# Altium schematic sheet Linear regulators.SchDoc (part 3 of 3)
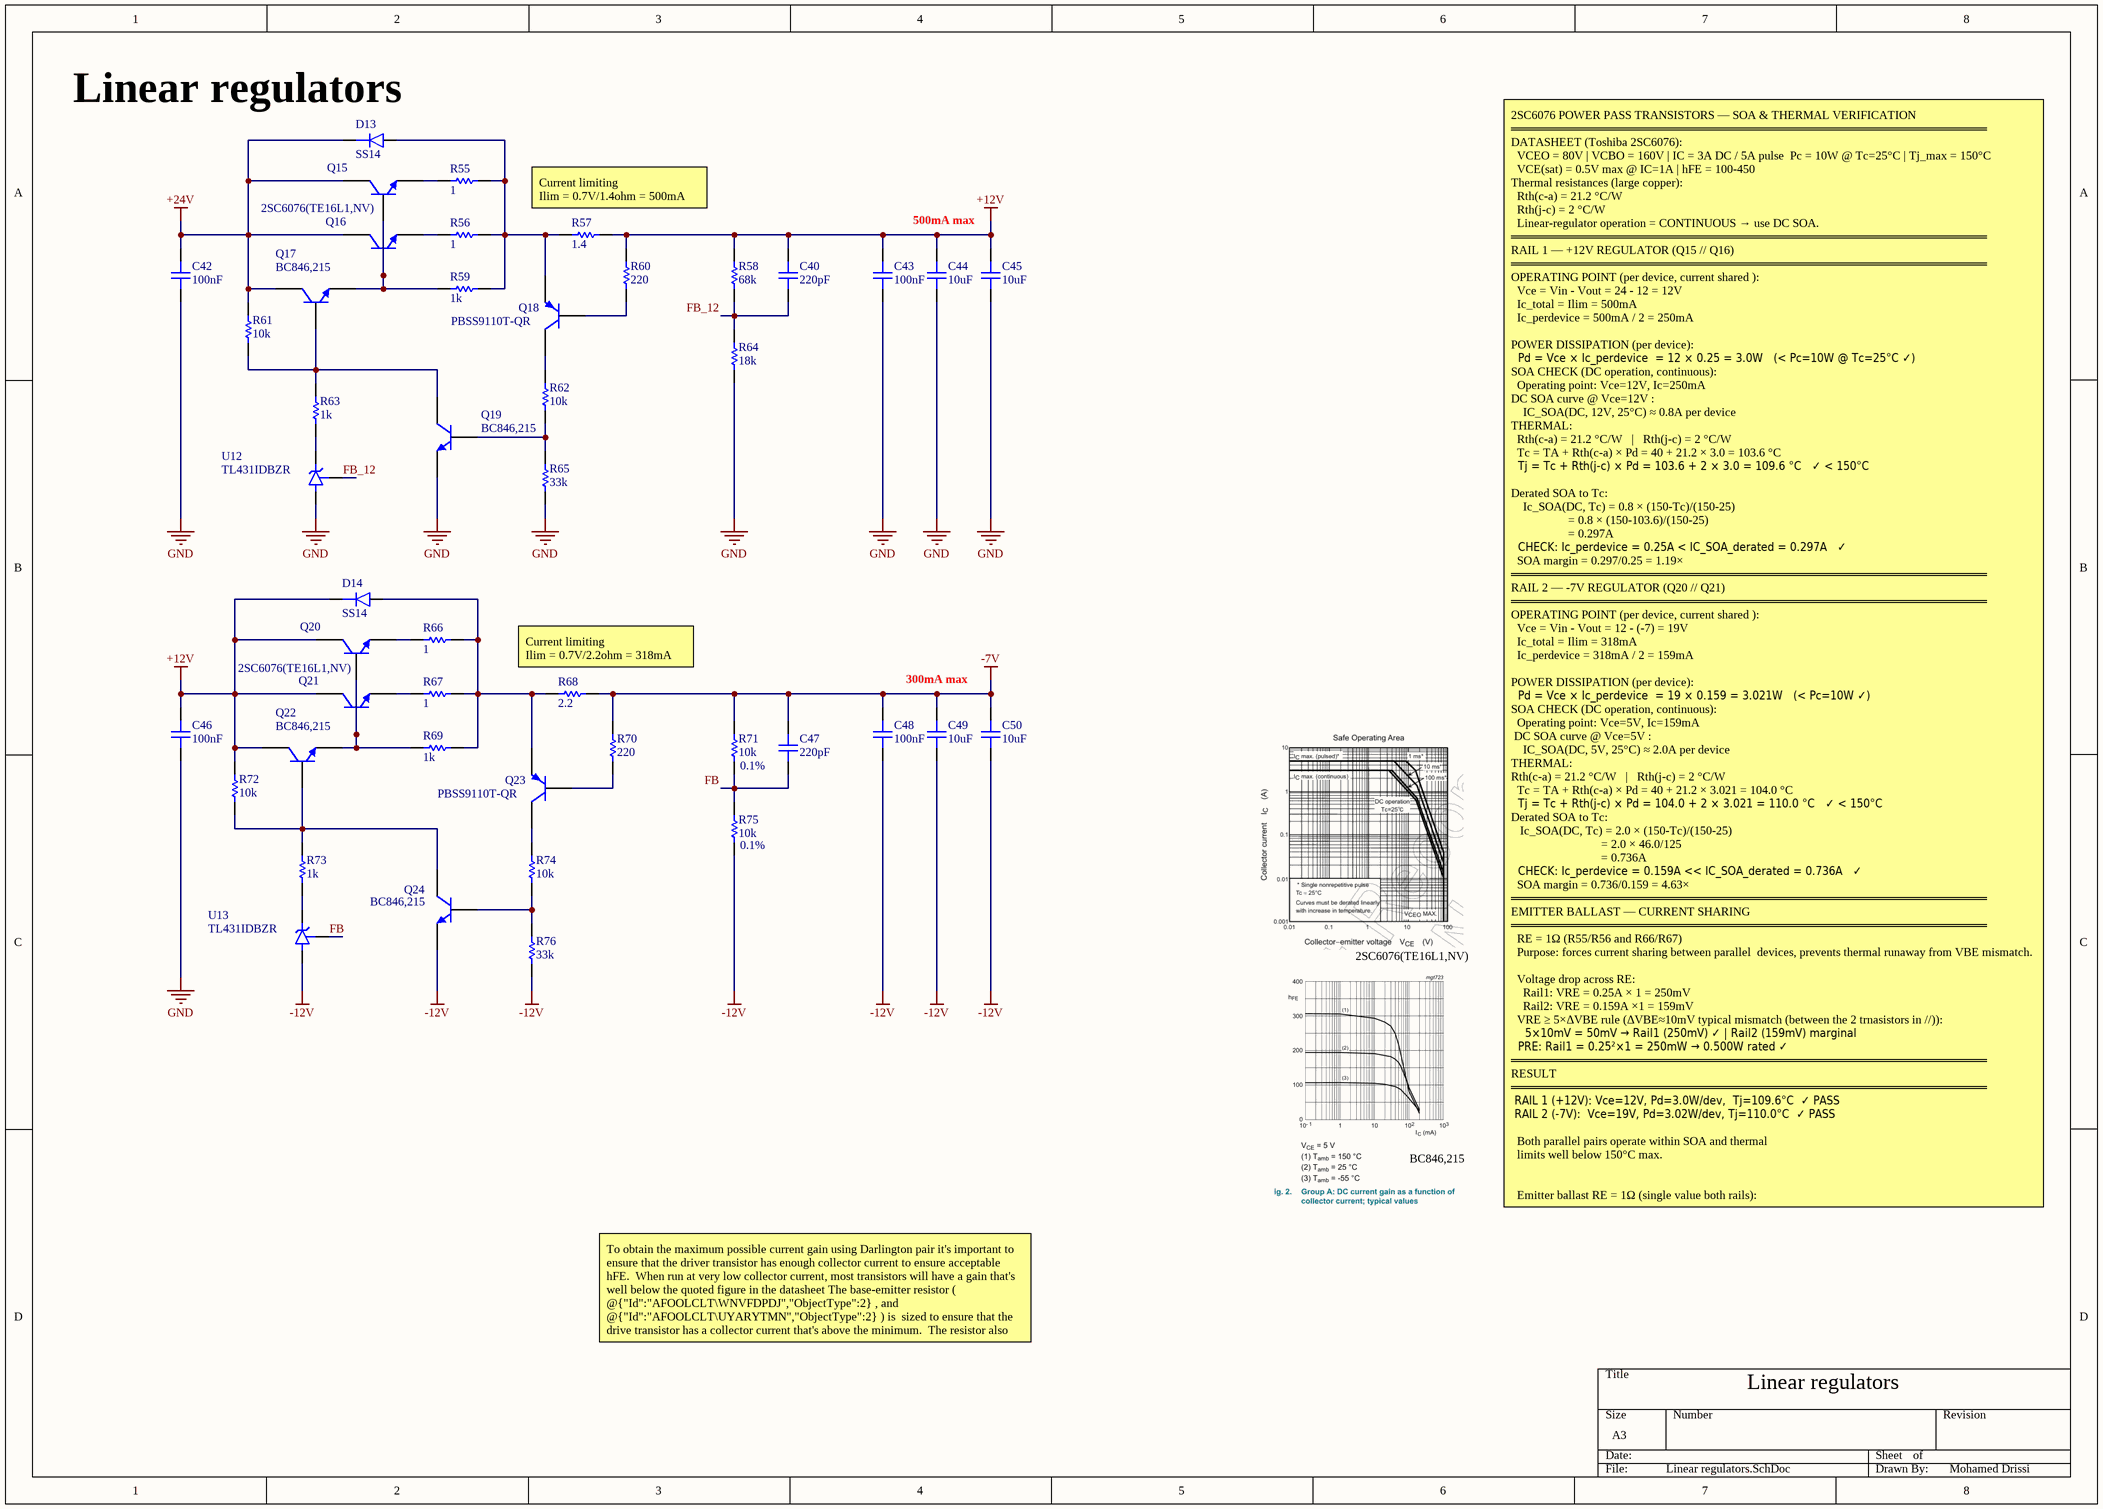
[diagram p2: Linear regulators.SchDoc]

## Library data of the parts (continued)
R65 R76 = Yageo RC0603JR-0733KL: 100mW Thick Film Resistors 75V ±100ppm/℃ ±5% 33kΩ 0603 Chip Resistor - Surface Mount ROHS; Manufacturer: Yageo Group; Temperature Coefficient: 100ppm/°C; Voltage Rating (AC): 50V; Supplier: RS; Supplier Part Number: 2426788; Manufacturer Part Number: RC0603JR-0733KL; RoHS: Compliant; Category: Chip SMD Resistors; Stock: 3000; Pricing: 100=0,006, 1000=0,005, 2000=0,004 (EUR); Case/Package: 0603; Case Code (Imperial): 0603; China RoHS: Non-Compliant; Composition: Thick Film; Depth: 800µm; Features: Moisture Resistant; Height: 450µm; Lead Free: Lead Free; Length: 1.6mm; Lifecycle Status: Production; Max Operating Temperature: 155°C; Max Power Dissipation: 100mW; Military Standard: Not; Min Operating Temperature: -55°C; Mounting Technology: Surface Mount; Pins: 2; Number of Terminals: 2; Number of Terminations: 2; Packaging: Tape & Reel; Power Rating: 100mW; REACH SVHC: Yes; Schedule B: 8533210045, 8533210045|8533210045|8533210045|8533210045|8533210045|8533210045|8533210045|8533210045|8533210045|8533210045|8533210045|8533210045|8533210045, 8533210045|8533210045|8533210045|8533210045|8533210045|8533210045|8533210045|8533210045|8533210045|8533210045|8533210045|8533210045|8533210045|8533210045, 8533210045|8533210045|8533210045|8533210045|8533210045|8533210045|8533210045|8533210045|8533210045|8533210045|8533210045|8533210045|8533210045|8533210045|8533210045; Termination: SMD/SMT; Tolerance: 5%; Voltage Rating: 75V; Voltage Rating (DC): 50V; Weight: 2.012816mg; Width: 800µm; Working Voltage: 75V; ComponentLink1URL: https://datasheet.octopart.com:443/RC0603JR-0733KL-Yageo-datasheet-175887523.pdf?src-supplier=Newark; ComponentLink1Description: https://datasheet.octopart.com:443/RC0603JR-0733KL-Yageo-datasheet-175887523.pdf?src-supplier=Newark; ComponentLink2URL: https://datasheet.octopart.com:443/RC0603JR-0733KL-Yageo-datasheet-8328172.pdf?src-supplier=Newark; ComponentLink2Description: https://datasheet.octopart.com:443/RC0603JR-0733KL-Yageo-datasheet-8328172.pdf?src-supplier=Newark; ComponentLink3URL: https://datasheet.octopart.com:443/RC0603JR-0733KL-Yageo-Group-datasheet-190305687.pdf?src-supplier=Future+Electronics; ComponentLink3Description: https://datasheet.octopart.com:443/RC0603JR-0733KL-Yageo-Group-datasheet-190305687.pdf?src-supplier=Future+Electronics; ComponentLink4URL: https://datasheet.octopart.com:443/RC0603JR-0733KL-Yageo-datasheet-164759695.pdf?src-supplier=Future+Electronics; ComponentLink4Description: https://datasheet.octopart.com:443/RC0603JR-0733KL-Yageo-datasheet-164759695.pdf?src-supplier=Future+Electronics; ComponentLink5URL: https://datasheet.octopart.com:443/RC0603JR-0733KL-Yageo-datasheet-137700087.pdf?src-supplier=Future+Electronics; ComponentLink5Description: https://datasheet.octopart.com:443/RC0603JR-0733KL-Yageo-datasheet-137700087.pdf?src-supplier=Future+Electronics; ComponentLink6URL: https://datasheet.octopart.com:443/RC0603JR-0733KL-Yageo-datasheet-27584510.pdf?src-supplier=Future+Electronics; ComponentLink6Description: https://datasheet.octopart.com:443/RC0603JR-0733KL-Yageo-datasheet-27584510.pdf?src-supplier=Future+Electronics; ComponentLink7URL: https://datasheet.octopart.com:443/RC0603JR-0733KL-Yageo-datasheet-15599030.pdf?src-supplier=Future+Electronics; ComponentLink7Description: https://datasheet.octopart.com:443/RC0603JR-0733KL-Yageo-datasheet-15599030.pdf?src-supplier=Future+Electronics; ComponentLink8URL: https://datasheet.octopart.com:443/RC0603JR-0733KL-Yageo-datasheet-12596169.pdf?src-supplier=Future+Electronics; ComponentLink8Description: https://datasheet.octopart.com:443/RC0603JR-0733KL-Yageo-datasheet-12596169.pdf?src-supplier=Future+Electronics; ComponentLink9URL: https://datasheet.octopart.com:443/RC0603JR-0733KL-Yageo-datasheet-8324193.pdf?src-supplier=Future+Electronics; ComponentLink9Description: https://datasheet.octopart.com:443/RC0603JR-0733KL-Yageo-datasheet-8324193.pdf?src-supplier=Future+Electronics; ComponentLink10URL: https://datasheet.octopart.com:443/RC0603JR-0733KL-Yageo-datasheet-62067350.pdf?src-supplier=element14+APAC; ComponentLink10Description: https://datasheet.octopart.com:443/RC0603JR-0733KL-Yageo-datasheet-62067350.pdf?src-supplier=element14+APAC; ComponentLink11URL: https://datasheet.octopart.com:443/RC0603JR-0733KL-Yageo-datasheet-34211833.pdf?src-supplier=element14+APAC; ComponentLink11Description: https://datasheet.octopart.com:443/RC0603JR-0733KL-Yageo-datasheet-34211833.pdf?src-supplier=element14+APAC; ComponentLink12URL: https://datasheet.octopart.com/RC0603JR-0733KL-Yageo-datasheet-73766026.pdf; ComponentLink12Description: https://datasheet.octopart.com/RC0603JR-0733KL-Yageo-datasheet-73766026.pdf; ComponentLink13URL: https://datasheet.octopart.com:443/RC0603JR-0733KL-Yageo-datasheet-118562.pdf?src-supplier=DigiKey; ComponentLink13Description: https://datasheet.octopart.com:443/RC0603JR-0733KL-Yageo-datasheet-118562.pdf?src-supplier=DigiKey; ComponentLink14URL: http://sigma.octopart.com:80/conflict_mineral_statement/Yageo-company-3.pdf?src-supplier=Compliance+Statements; ComponentLink14Description: http://sigma.octopart.com:80/conflict_mineral_statement/Yageo-company-3.pdf?src-supplier=Compliance+Statements; ComponentLink15URL: http://sigma.octopart.com:80/rohs_statement/Yageo-company-2.pdf?src-supplier=Compliance+Statements; ComponentLink15Description: http://sigma.octopart.com:80/rohs_statement/Yageo-company-2.pdf?src-supplier=Compliance+Statements
R68 = Bourns CRM1206-JW-2R2ELF: Res Thick Film 1206 2.2 Ohm 5% 0.5W(1/2W) ±200ppm/C Pad SMD T/R; Manufacturer: Bourns; Max Power Dissipation: 500mW; Temperature Coefficient: 200ppm/°C; Voltage Rating: 200V; Supplier: RS; Supplier Part Number: 630160; Manufacturer Part Number: CRM1206-JW-2R2ELF; RoHS: Compliant; Category: Chip SMD Resistors; Stock: 9920; Pricing: 20=0,049, 500=0,042, 2000=0,032, 10000=0,028, 20000=0,021 (EUR); Case/Package: 1206; Case Code (Imperial): 1206; Case Code (Metric): 3216; China RoHS: Non-Compliant; Composition: Thick Film; Country of Origin: Taiwan; Depth: 1.6mm; Export Control Classification Number (ECCN) Code: EAR99; Height: 550µm; Harmonized Tariff Schedule (HTS) Code: 8533.21.00.30; Introduction Date: 2011-02-17; Length: 3.1mm; Lifecycle Status: Production; Max Operating Temperature: 155°C; Military Standard: Not; Min Operating Temperature: -55°C; Mounting Technology: Surface Mount; Pins: 2; Number of Terminals: 2; Number of Terminations: 2; Packaging: Cut Tape; Power Rating: 500mW; REACH SVHC: Yes; Schedule B: 8533210045, 8533210045|8533210045, 8533210045|8533210045|8533210045, 8533210045|8533210045|8533210045|8533210045; Tolerance: 5%; Voltage Rating (DC): 200V; Width: 1.6mm; Working Voltage: 200V; ComponentLink1URL: https://datasheet.octopart.com:443/CRM1206-JW-2R2ELF-Bourns-datasheet-182141858.pdf?src-supplier=Master+Electronics; ComponentLink1Description: https://datasheet.octopart.com:443/CRM1206-JW-2R2ELF-Bourns-datasheet-182141858.pdf?src-supplier=Master+Electronics; ComponentLink2URL: https://datasheet.octopart.com:443/CRM1206-JW-2R2ELF-Bourns-datasheet-164353756.pdf?src-supplier=JRH+Electronics; ComponentLink2Description: https://datasheet.octopart.com:443/CRM1206-JW-2R2ELF-Bourns-datasheet-164353756.pdf?src-supplier=JRH+Electronics; ComponentLink3URL: https://datasheet.octopart.com:443/CRM1206-JW-2R2ELF-Bourns-datasheet-97424573.pdf?src-supplier=Burklin+Elektronik; ComponentLink3Description: https://datasheet.octopart.com:443/CRM1206-JW-2R2ELF-Bourns-datasheet-97424573.pdf?src-supplier=Burklin+Elektronik; ComponentLink4URL: https://datasheet.octopart.com:443/CRM1206-JW-2R2ELF-Bourns-datasheet-154729671.pdf?src-supplier=Electro+Sonic; ComponentLink4Description: https://datasheet.octopart.com:443/CRM1206-JW-2R2ELF-Bourns-datasheet-154729671.pdf?src-supplier=Electro+Sonic; ComponentLink5URL: https://datasheet.octopart.com:443/CRM1206-JW-2R2ELF-Bourns-datasheet-10026694.pdf?src-supplier=element14; ComponentLink5Description: https://datasheet.octopart.com:443/CRM1206-JW-2R2ELF-Bourns-datasheet-10026694.pdf?src-supplier=element14; ComponentLink6URL: https://datasheet.octopart.com:443/CRM1206-JW-2R2ELF-Bourns-datasheet-33021211.pdf?src-supplier=Newark; ComponentLink6Description: https://datasheet.octopart.com:443/CRM1206-JW-2R2ELF-Bourns-datasheet-33021211.pdf?src-supplier=Newark; ComponentLink7URL: https://datasheet.octopart.com:443/CRM1206-JW-2R2ELF-Bourns-datasheet-27379021.pdf?src-supplier=Newark; ComponentLink7Description: https://datasheet.octopart.com:443/CRM1206-JW-2R2ELF-Bourns-datasheet-27379021.pdf?src-supplier=Newark; ComponentLink8URL: https://datasheet.octopart.com:443/CRM1206-JW-2R2ELF-Bourns-datasheet-21196278.pdf?src-supplier=Newark; ComponentLink8Description: https://datasheet.octopart.com:443/CRM1206-JW-2R2ELF-Bourns-datasheet-21196278.pdf?src-supplier=Newark; ComponentLink9URL: http://sigma.octopart.com:80/conflict_mineral_statement/Bourns-company-36.pdf?src-supplier=Compliance+Statements; ComponentLink9Description: http://sigma.octopart.com:80/conflict_mineral_statement/Bourns-company-36.pdf?src-supplier=Compliance+Statements
U12 U13 = TI TL431IDBZR: V-Ref Adjustable 2.495V to 36V 100mA Automotive 3-Pin SOT-23 T/R; Manufacturer: Texas Instruments; Manufacturer Lifecycle Status: ACTIVE; Cathode Current: 1mA; Max Supply Voltage: 37V; Number of Channels: 1; Reference Type: Adjustable, Shunt; Temperature Coefficient: 34ppm/°C; Tolerance: 2%; Supplier: Arrow Electronics; Supplier Part Number: TL431IDBZR; Manufacturer Part Number: TL431IDBZR; RoHS: Compliant; Category: Voltage References; Stock: 51000; Pricing: 3000=0,0918, 6000=0,0907, 9000=0,0882, 15000=0,0874, 21000=0,0865, 30000=0,0823 (USD); Case/Package: SOT-23; Height: 1.22mm; Lead Free: Lead Free; Length: 2.92mm; Lifecycle Status: Production; Max Operating Temperature: 85°C; Max Output current: 100mA; Max Output Voltage: 36V; Min Input Voltage: 2.495V; Min Operating Temperature: -40°C; Pins: 3; Output Current: 100mA; Output Voltage: 36V; Packaging: Cut Tape; Radiation Hardening: No; REACH SVHC: No; Reference Voltage: 36V; Schedule B: 8542390000, 8542390000|8542390000|8542390000|8542390000|8542390000; Thickness: 1mm; Weight: 1.437803g; Width: 1.3mm; ComponentLink1URL: https://sigma.octopart.com:443/179129137/technical_drawing/Texas-Instruments-TL431IDBZR.pdf?src-supplier=Texas+Instruments; ComponentLink1Description: https://sigma.octopart.com:443/179129137/technical_drawing/Texas-Instruments-TL431IDBZR.pdf?src-supplier=Texas+Instruments; ComponentLink2URL: https://octopart.com:443/opatz8j6/c1?t=rW6bIrba_jbvmB_uabgQ4DHQ_8bXebmw5n36TFgajg_cM10sTUMOa3c0_aROWTzNuODAPxgdzkUCyLMyjqW5ECfNLnsPaaELSSqte_UXEwTAXn63sCq0zOIbeu3rbiILGc0xAKExe2TPYtg5Ms4ml5aZB-hP2d9WeynMm8uqMp-0nIZVL-dEP5eqV8i1QpquQEXyisrE4V8pFSHbvg01nxHcb9gAO0LAPA1OgW6fj5N8dHmskhhoOlj6gaEdyF9jXEJmJUbnrXDzuao32M8w1z1jkibRnCgcbwk3b-Z8PYiflKC4Jzxffmw6AAaWjNeE2_Iqkn9MenYhHERA89N4870fEFKw1TPybVjTNvPhj-8IMEBDTyhXkE4nZuLn3P6NpQ&src-supplier=Texas+Instruments; ComponentLink2Description: https://octopart.com:443/opatz8j6/c1?t=rW6bIrba_jbvmB_uabgQ4DHQ_8bXebmw5n36TFgajg_cM10sTUMOa3c0_aROWTzNuODAPxgdzkUCyLMyjqW5ECfNLnsPaaELSSqte_UXEwTAXn63sCq0zOIbeu3rbiILGc0xAKExe2TPYtg5Ms4ml5aZB-hP2d9WeynMm8uqMp-0nIZVL-dEP5eqV8i1QpquQEXyisrE4V8pFSHbvg01nxHcb9gAO0LAPA1OgW6fj5N8dHmskhhoOlj6gaEdyF9jXEJmJUbnrXDzuao32M8w1z1jkibRnCgcbwk3b-Z8PYiflKC4Jzxffmw6AAaWjNeE2_Iqkn9MenYhHERA89N4870fEFKw1TPybVjTNvPhj-8IMEBDTyhXkE4nZuLn3P6NpQ&src-supplier=Texas+Instruments; ComponentLink3URL: https://sigma.octopart.com:443/169406038/technical_drawing/Texas-Instruments-TL431IDBZR.pdf?src-supplier=Texas+Instruments; ComponentLink3Description: https://sigma.octopart.com:443/169406038/technical_drawing/Texas-Instruments-TL431IDBZR.pdf?src-supplier=Texas+Instruments; ComponentLink4URL: https://sigma.octopart.com:443/80351974/technical_drawing/Texas-Instruments-TL431IDBZR.pdf?src-supplier=Texas+Instruments; ComponentLink4Description: https://sigma.octopart.com:443/80351974/technical_drawing/Texas-Instruments-TL431IDBZR.pdf?src-supplier=Texas+Instruments; ComponentLink5URL: https://sigma.octopart.com:443/78374974/technical_drawing/Texas-Instruments-TL431IDBZR.pdf?src-supplier=Texas+Instruments; ComponentLink5Description: https://sigma.octopart.com:443/78374974/technical_drawing/Texas-Instruments-TL431IDBZR.pdf?src-supplier=Texas+Instruments; ComponentLink6URL: https://datasheet.octopart.com:443/TL431IDBZR-Texas-Instruments-datasheet-41217836.pdf?src-supplier=Texas+Instruments; ComponentLink6Description: https://datasheet.octopart.com:443/TL431IDBZR-Texas-Instruments-datasheet-41217836.pdf?src-supplier=Texas+Instruments; ComponentLink7URL: https://datasheet.octopart.com:443/TL431IDBZR-Texas-Instruments-datasheet-37140784.pdf?src-supplier=Texas+Instruments; ComponentLink7Description: https://datasheet.octopart.com:443/TL431IDBZR-Texas-Instruments-datasheet-37140784.pdf?src-supplier=Texas+Instruments; ComponentLink8URL: https://datasheet.octopart.com:443/TL431IDBZR-Texas-Instruments-datasheet-22066926.pdf?src-supplier=Texas+Instruments; ComponentLink8Description: https://datasheet.octopart.com:443/TL431IDBZR-Texas-Instruments-datasheet-22066926.pdf?src-supplier=Texas+Instruments; ComponentLink9URL: https://datasheet.octopart.com:443/TL431IDBZR-Texas-Instruments-datasheet-11514612.pdf?src-supplier=Texas+Instruments; ComponentLink9Description: https://datasheet.octopart.com:443/TL431IDBZR-Texas-Instruments-datasheet-11514612.pdf?src-supplier=Texas+Instruments; ComponentLink10URL: https://datasheet.octopart.com:443/TL431IDBZR-Texas-Instruments-datasheet-149617.pdf?src-supplier=Texas+Instruments; ComponentLink10Description: https://datasheet.octopart.com:443/TL431IDBZR-Texas-Instruments-datasheet-149617.pdf?src-supplier=Texas+Instruments; ComponentLink11URL: https://sigma.octopart.com:443/49250660/technical_drawing/Texas-Instruments-TL431IDBZR.pdf?src-supplier=Texas+Instruments; ComponentLink11Description: https://sigma.octopart.com:443/49250660/technical_drawing/Texas-Instruments-TL431IDBZR.pdf?src-supplier=Texas+Instruments; ComponentLink12URL: https://datasheet.octopart.com:443/TL431IDBZR-Texas-Instruments-datasheet-10255933.pdf?src-supplier=Texas+Instruments; ComponentLink12Description: https://datasheet.octopart.com:443/TL431IDBZR-Texas-Instruments-datasheet-10255933.pdf?src-supplier=Texas+Instruments; ComponentLink13URL: https://datasheet.octopart.com:443/TL431IDBZR-Texas-Instruments-datasheet-81843928.pdf?src-supplier=Upverter; ComponentLink13Description: https://datasheet.octopart.com:443/TL431IDBZR-Texas-Instruments-datasheet-81843928.pdf?src-supplier=Upverter; ComponentLink14URL: https://datasheet.octopart.com:443/TL431IDBZR-Texas-Instruments-datasheet-14437413.pdf?src-supplier=Upverter; ComponentLink14Description: https://datasheet.octopart.com:443/TL431IDBZR-Texas-Instruments-datasheet-14437413.pdf?src-supplier=Upverter; ComponentLink15URL: https://datasheet.octopart.com:443/TL431IDBZR-Texas-Instruments-datasheet-66581701.pdf?src-supplier=Farnell; ComponentLink15Description: https://datasheet.octopart.com:443/TL431IDBZR-Texas-Instruments-datasheet-66581701.pdf?src-supplier=Farnell; ComponentLink16URL: https://datasheet.octopart.com:443/TL431IDBZR-Texas-Instruments-datasheet-165804567.pdf?src-supplier=LCSC; ComponentLink16Description: https://datasheet.octopart.com:443/TL431IDBZR-Texas-Instruments-datasheet-165804567.pdf?src-supplier=LCSC; ComponentLink17URL: https://datasheet.octopart.com:443/TL431IDBZR-Texas-Instruments-datasheet-159117715.pdf?src-supplier=LCSC; ComponentLink17Description: https://datasheet.octopart.com:443/TL431IDBZR-Texas-Instruments-datasheet-159117715.pdf?src-supplier=LCSC; ComponentLink18URL: https://datasheet.octopart.com:443/TL431IDBZR-Texas-Instruments-datasheet-164418451.pdf?src-supplier=SHENGYU+ELECTRONICS; ComponentLink18Description: https://datasheet.octopart.com:443/TL431IDBZR-Texas-Instruments-datasheet-164418451.pdf?src-supplier=SHENGYU+ELECTRONICS; ComponentLink19URL: https://datasheet.octopart.com:443/TL431IDBZR-Texas-Instruments-datasheet-95954503.pdf?src-supplier=TME; ComponentLink19Description: https://datasheet.octopart.com:443/TL431IDBZR-Texas-Instruments-datasheet-95954503.pdf?src-supplier=TME; ComponentLink20URL: https://datasheet.octopart.com:443/TL431IDBZR-Texas-Instruments-datasheet-137316104.pdf?src-supplier=Future+Electronics; ComponentLink20Description: https://datasheet.octopart.com:443/TL431IDBZR-Texas-Instruments-datasheet-137316104.pdf?src-supplier=Future+Electronics; ComponentLink21URL: https://datasheet.octopart.com:443/TL431IDBZR-Texas-Instruments-datasheet-38226331.pdf?src-supplier=Newark; ComponentLink21Description: https://datasheet.octopart.com:443/TL431IDBZR-Texas-Instruments-datasheet-38226331.pdf?src-supplier=Newark; ComponentLink22URL: https://datasheet.octopart.com:443/TL431IDBZR-Texas-Instruments-datasheet-37140351.pdf?src-supplier=Newark; ComponentLink22Description: https://datasheet.octopart.com:443/TL431IDBZR-Texas-Instruments-datasheet-37140351.pdf?src-supplier=Newark; ComponentLink23URL: https://datasheet.octopart.com:443/TL431IDBZR-Texas-Instruments-datasheet-33011757.pdf?src-supplier=Newark; ComponentLink23Description: https://datasheet.octopart.com:443/TL431IDBZR-Texas-Instruments-datasheet-33011757.pdf?src-supplier=Newark; ComponentLink24URL: https://datasheet.octopart.com:443/TL431IDBZR-Texas-Instruments-datasheet-10882568.pdf?src-supplier=Arrow+Electronics; ComponentLink24Description: https://datasheet.octopart.com:443/TL431IDBZR-Texas-Instruments-datasheet-10882568.pdf?src-supplier=Arrow+Electronics; ComponentLink25URL: https://datasheet.octopart.com:443/TL431IDBZR-Texas-Instruments-datasheet-10218417.pdf?src-supplier=element14; ComponentLink25Description: https://datasheet.octopart.com:443/TL431IDBZR-Texas-Instruments-datasheet-10218417.pdf?src-supplier=element14; ComponentLink26URL: https://datasheet.octopart.com:443/TL431IDBZR-Texas-Instruments-datasheet-10027895.pdf?src-supplier=element14; ComponentLink26Description: https://datasheet.octopart.com:443/TL431IDBZR-Texas-Instruments-datasheet-10027895.pdf?src-supplier=element14; ComponentLink27URL: https://datasheet.octopart.com:443/TL431IDBZR-Texas-Instruments-datasheet-8886313.pdf?src-supplier=element14; ComponentLink27Description: https://datasheet.octopart.com:443/TL431IDBZR-Texas-Instruments-datasheet-8886313.pdf?src-supplier=element14; ComponentLink28URL: https://datasheet.octopart.com:443/TL431IDBZR-Texas-Instruments-datasheet-8826676.pdf?src-supplier=element14; ComponentLink28Description: https://datasheet.octopart.com:443/TL431IDBZR-Texas-Instruments-datasheet-8826676.pdf?src-supplier=element14; ComponentLink29URL: https://datasheet.octopart.com:443/TL431IDBZR-Texas-Instruments-datasheet-8735770.pdf?src-supplier=element14; ComponentLink29Description: https://datasheet.octopart.com:443/TL431IDBZR-Texas-Instruments-datasheet-8735770.pdf?src-supplier=element14; ComponentLink30URL: https://datasheet.octopart.com:443/TL431IDBZR-Texas-Instruments-datasheet-8724803.pdf?src-supplier=element14; ComponentLink30Description: https://datasheet.octopart.com:443/TL431IDBZR-Texas-Instruments-datasheet-8724803.pdf?src-supplier=element14; ComponentLink31URL: https://datasheet.octopart.com:443/TL431IDBZR-Texas-Instruments-datasheet-8463480.pdf?src-supplier=element14; ComponentLink31Description: https://datasheet.octopart.com:443/TL431IDBZR-Texas-Instruments-datasheet-8463480.pdf?src-supplier=element14; ComponentLink32URL: https://datasheet.octopart.com:443/TL431IDBZR-Texas-Instruments-datasheet-7546206.pdf?src-supplier=element14; ComponentLink32Description: https://datasheet.octopart.com:443/TL431IDBZR-Texas-Instruments-datasheet-7546206.pdf?src-supplier=element14; ComponentLink33URL: https://datasheet.octopart.com:443/TL431IDBZR-Texas-Instruments-datasheet-5314698.pdf?src-supplier=element14; ComponentLink33Description: https://datasheet.octopart.com:443/TL431IDBZR-Texas-Instruments-datasheet-5314698.pdf?src-supplier=element14; ComponentLink34URL: https://datasheet.octopart.com:443/TL431IDBZR-Texas-Instruments-datasheet-8441549.pdf?src-supplier=Jameco; ComponentLink34Description: https://datasheet.octopart.com:443/TL431IDBZR-Texas-Instruments-datasheet-8441549.pdf?src-supplier=Jameco; ComponentLink35URL: https://datasheet.octopart.com:443/TL431IDBZR-Texas-Instruments-datasheet-153618.pdf?src-supplier=Mouser; ComponentLink35Description: https://datasheet.octopart.com:443/TL431IDBZR-Texas-Instruments-datasheet-153618.pdf?src-supplier=Mouser; ComponentLink36URL: https://datasheet.octopart.com:443/TL431IDBZR-Texas-Instruments-datasheet-3065.pdf?src-supplier=DigiKey; ComponentLink36Description: https://datasheet.octopart.com:443/TL431IDBZR-Texas-Instruments-datasheet-3065.pdf?src-supplier=DigiKey; ComponentLink37URL: https://datasheet.octopart.com:443/TL431IDBZR-Texas-Instruments-datasheet-112754.pdf?src-supplier=Sierra+IC; ComponentLink37Description: https://datasheet.octopart.com:443/TL431IDBZR-Texas-Instruments-datasheet-112754.pdf?src-supplier=Sierra+IC; ComponentLink38URL: http://sigma.octopart.com:80/reach_statement/Texas-Instruments-company-64.pdf?src-supplier=Compliance+Statements; ComponentLink38Description: http://sigma.octopart.com:80/reach_statement/Texas-Instruments-company-64.pdf?src-supplier=Compliance+Statements; ComponentLink39URL: http://sigma.octopart.com:80/conflict_mineral_statement/Texas-Instruments-company-63.pdf?src-supplier=Compliance+Statements; ComponentLink39Description: http://sigma.octopart.com:80/conflict_mineral_statement/Texas-Instruments-company-63.pdf?src-supplier=Compliance+Statements